# Altium schematic sheet 2_ZynTra-Zynq-Power.SchDoc
size 457 x 279 mm; DocumentNumber: 3; SheetNumber: 2; SheetTotal: 10
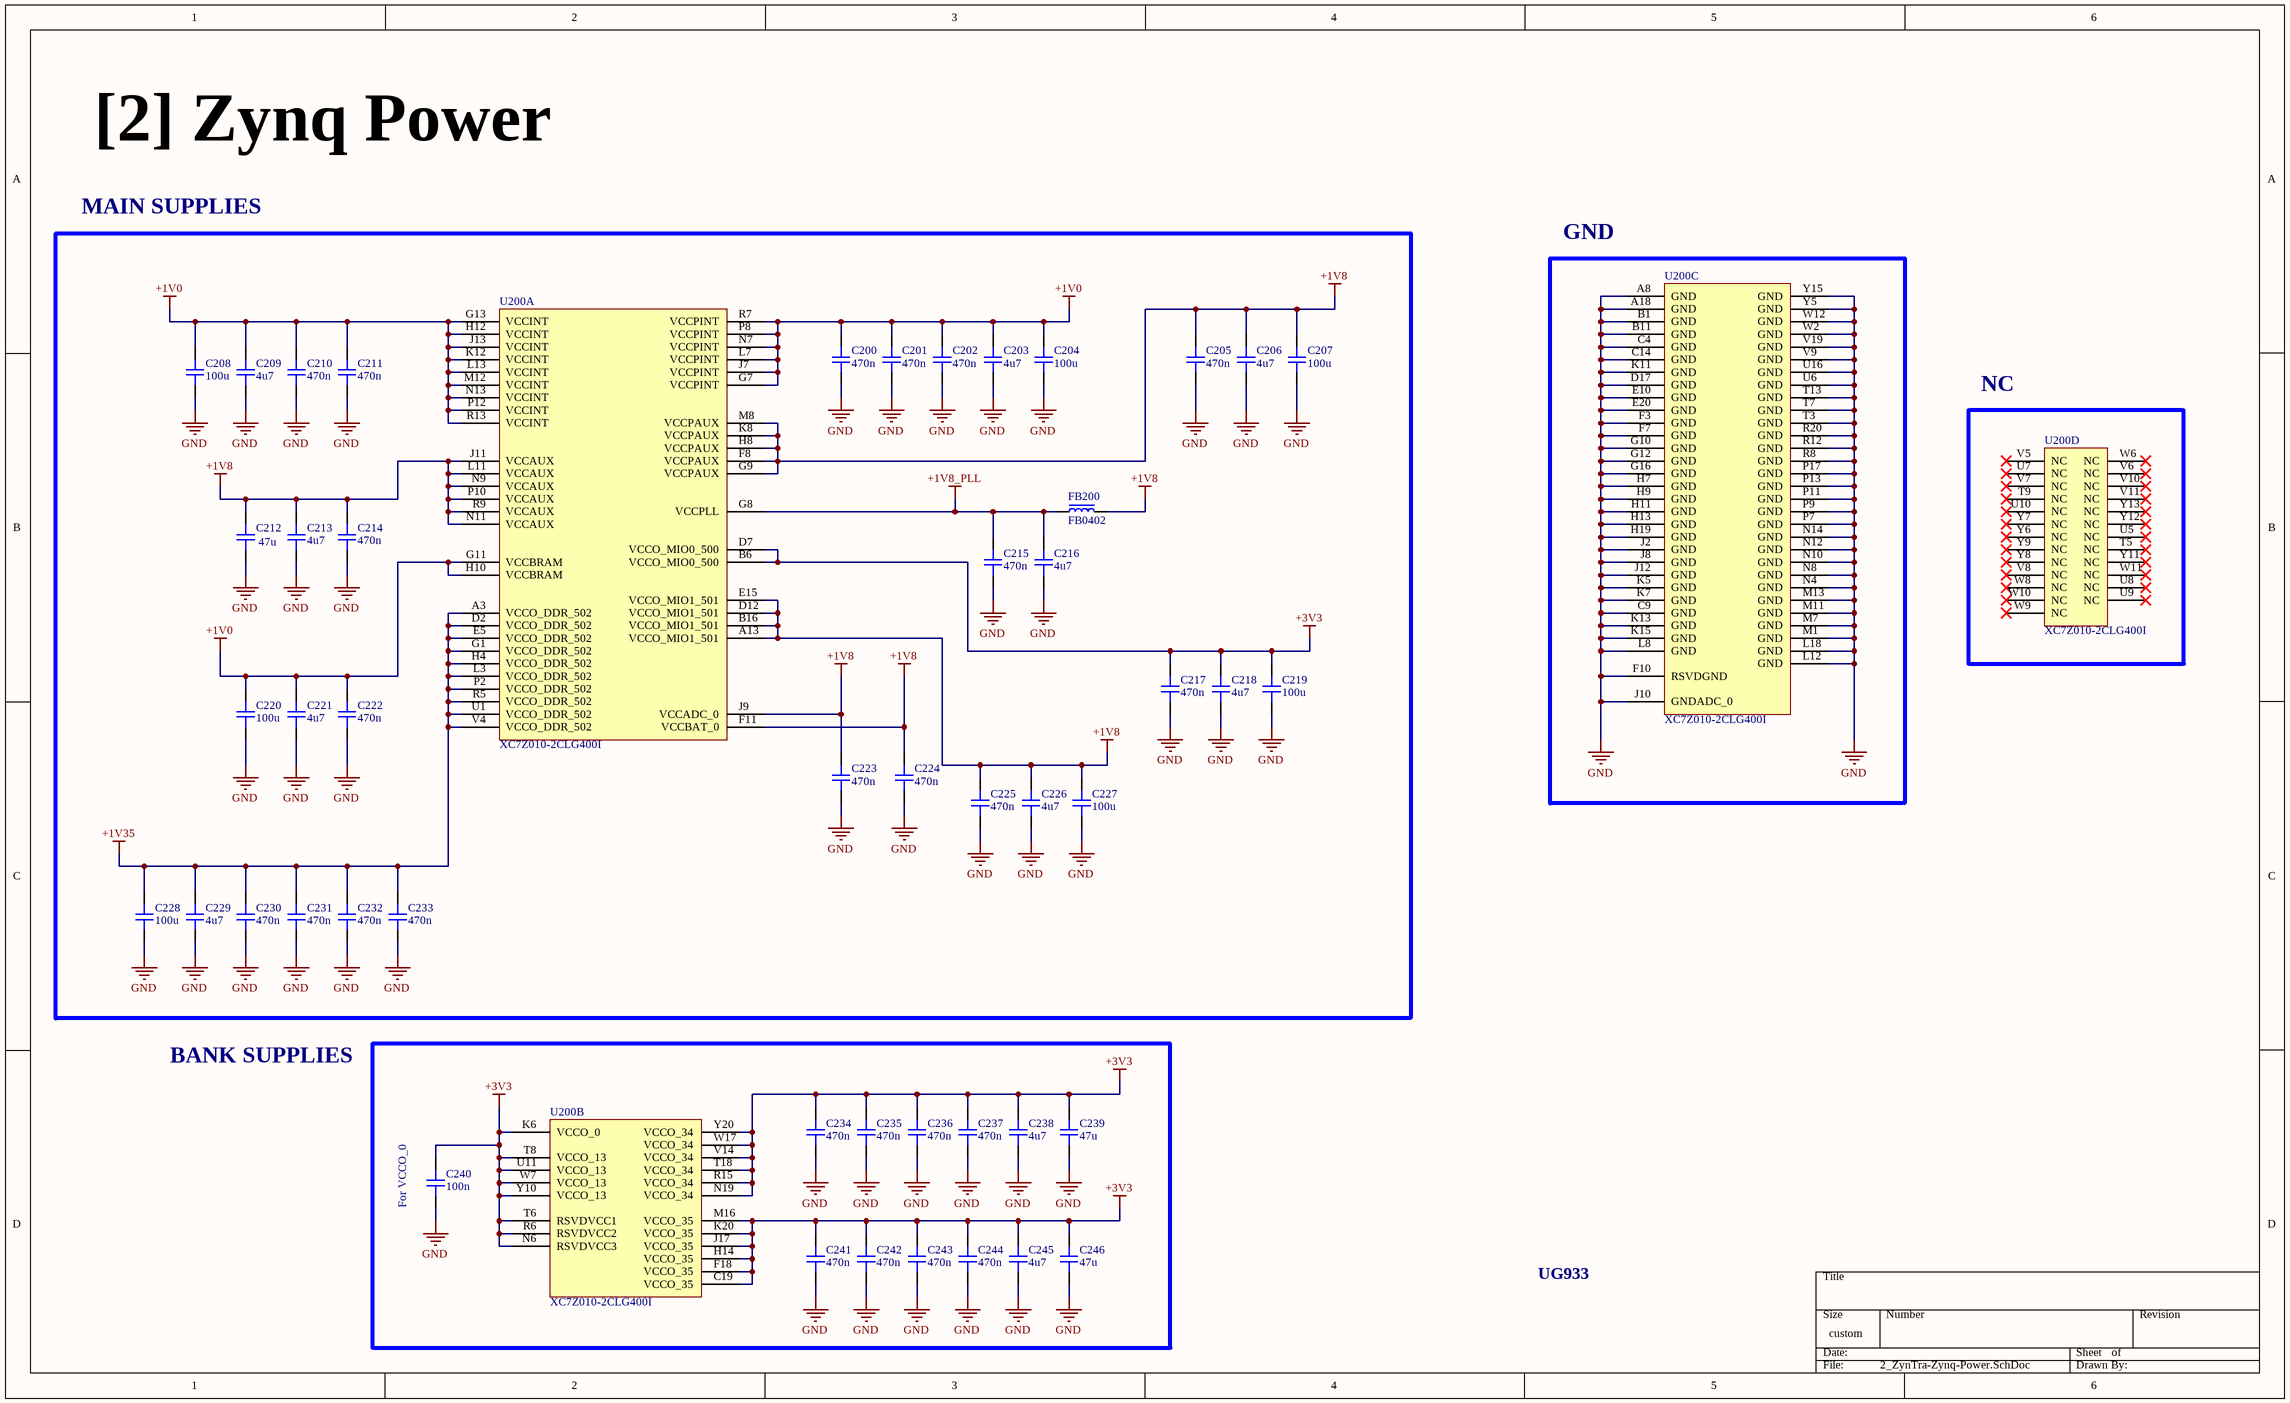
[diagram p0: 2_ZynTra-Zynq-Power.SchDoc]

## Parts
C200  470n  [CAP_0201]
C201  470n  [CAP_0201]
C202  470n  [CAP_0201]
C203  4u7  [CAP_0402]
C204  100u  [CAP_1206]
C205  470n  [CAP_0201]
C206  4u7  [CAP_0402]
C207  100u  [CAP_1206]
C208  100u  [CAP_1206]
C209  4u7  [CAP_0402]
C210  470n  [CAP_0201]
C211  470n  [CAP_0201]
C212  47u  [CAP_1206]
C213  4u7  [CAP_0402]
C214  470n  [CAP_0201]
C215  470n  [CAP_0201]
C216  4u7  [CAP_0402]
C217  470n  [CAP_0201]
C218  4u7  [CAP_0402]
C219  100u  [CAP_1206]
C220  100u  [CAP_1206]
C221  4u7  [CAP_0402]
C222  470n  [CAP_0201]
C223  470n  [CAP_0201]
C224  470n  [CAP_0201]
C225  470n  [CAP_0201]
C226  4u7  [CAP_0402]
C227  100u  [CAP_1206]
C228  100u  [CAP_1206]
C229  4u7  [CAP_0402]
C230  470n  [CAP_0201]
C231  470n  [CAP_0201]
C232  470n  [CAP_0201]
C233  470n  [CAP_0201]
C234  470n  [CAP_0201]
C235  470n  [CAP_0201]
C236  470n  [CAP_0201]
C237  470n  [CAP_0201]
C238  4u7  [CAP_0402]
C239  47u  [CAP_1206]
C240  100n  [CAP_0201]
C241  470n  [CAP_0201]
C242  470n  [CAP_0201]
C243  470n  [CAP_0201]
C244  470n  [CAP_0201]
C245  4u7  [CAP_0402]
C246  47u  [CAP_1206]
FB200  FB0402  [FB_0402]
U200  XC7Z010-2CLG400I  [CLG400, 0.8mm, 17x17]  (parts A,B,C,D of 9)

## Blocks framed on the sheet
MAIN SUPPLIES: C200-C233 FB200 U200
GND: U200
NC: U200
For VCCO_0: C234-C246 U200

## Nets
+1V0: C200.2 C201.2 C202.2 C203.2 C204.2 C208.2 C209.2 C210.2 C211.2 C220.2 C221.2 C222.2 U200.G7(VCCPINT) U200.G11(VCCBRAM) U200.G13(VCCINT) U200.H10(VCCBRAM) U200.H12(VCCINT) U200.J7(VCCPINT) U200.J13(VCCINT) U200.K12(VCCINT) U200.L7(VCCPINT) U200.L13(VCCINT) U200.M12(VCCINT) U200.N7(VCCPINT) U200.N13(VCCINT) U200.P8(VCCPINT) U200.P12(VCCINT) U200.R7(VCCPINT) U200.R13(VCCINT)
+1V8: C205.2 C206.2 C207.2 C212.2 C213.2 C214.2 C223.2 C224.2 C225.2 C226.2 C227.2 FB200.2 U200.A13(VCCO_MIO1_501) U200.B16(VCCO_MIO1_501) U200.D12(VCCO_MIO1_501) U200.E15(VCCO_MIO1_501) U200.F8(VCCPAUX) U200.F11(VCCBAT_0) U200.G9(VCCPAUX) U200.H8(VCCPAUX) U200.J9(VCCADC_0) U200.J11(VCCAUX) U200.K8(VCCPAUX) U200.L11(VCCAUX) U200.M8(VCCPAUX) U200.N9(VCCAUX) U200.N11(VCCAUX) U200.P10(VCCAUX) U200.R9(VCCAUX)
+1V8_PLL: C215.2 C216.2 FB200.1 U200.G8(VCCPLL)
+1V35: C228.2 C229.2 C230.2 C231.2 C232.2 C233.2 U200.A3(VCCO_DDR_502) U200.D2(VCCO_DDR_502) U200.E5(VCCO_DDR_502) U200.G1(VCCO_DDR_502) U200.H4(VCCO_DDR_502) U200.L3(VCCO_DDR_502) U200.P2(VCCO_DDR_502) U200.R5(VCCO_DDR_502) U200.U1(VCCO_DDR_502) U200.V4(VCCO_DDR_502)
+3V3: C217.2 C218.2 C219.2 C234.2 C235.2 C236.2 C237.2 C238.2 C239.2 C240.2 C241.2 C242.2 C243.2 C244.2 C245.2 C246.2 U200.B6(VCCO_MIO0_500) U200.C19(VCCO_35) U200.D7(VCCO_MIO0_500) U200.F18(VCCO_35) U200.H14(VCCO_35) U200.J17(VCCO_35) U200.K6(VCCO_0) U200.K20(VCCO_35) U200.M16(VCCO_35) U200.N6(RSVDVCC3) U200.N19(VCCO_34) U200.R6(RSVDVCC2) U200.R15(VCCO_34) U200.T6(RSVDVCC1) U200.T8(VCCO_13) U200.T18(VCCO_34) U200.U11(VCCO_13) U200.V14(VCCO_34) U200.W7(VCCO_13) U200.W17(VCCO_34) U200.Y10(VCCO_13) U200.Y20(VCCO_34)
GND: C200.1 C201.1 C202.1 C203.1 C204.1 C205.1 C206.1 C207.1 C208.1 C209.1 C210.1 C211.1 C212.1 C213.1 C214.1 C215.1 C216.1 C217.1 C218.1 C219.1 C220.1 C221.1 C222.1 C223.1 C224.1 C225.1 C226.1 C227.1 C228.1 C229.1 C230.1 C231.1 C232.1 C233.1 C234.1 C235.1 C236.1 C237.1 C238.1 C239.1 C240.1 C241.1 C242.1 C243.1 C244.1 C245.1 C246.1 U200.A8(GND) U200.A18(GND) U200.B1(GND) U200.B11(GND) U200.C4(GND) U200.C9(GND) U200.C14(GND) U200.D17(GND) U200.E10(GND) U200.E20(GND) U200.F3(GND) U200.F7(GND) U200.F10(RSVDGND) U200.G10(GND) U200.G12(GND) U200.G16(GND) U200.H7(GND) U200.H9(GND) U200.H11(GND) U200.H13(GND) U200.H19(GND) U200.J2(GND) U200.J8(GND) U200.J10(GNDADC_0) U200.J12(GND) U200.K5(GND) U200.K7(GND) U200.K11(GND) U200.K13(GND) U200.K15(GND) U200.L8(GND) U200.L12(GND) U200.L18(GND) U200.M1(GND) U200.M7(GND) U200.M11(GND) U200.M13(GND) U200.N4(GND) U200.N8(GND) U200.N10(GND) U200.N12(GND) U200.N14(GND) U200.P7(GND) U200.P9(GND) U200.P11(GND) U200.P13(GND) U200.P17(GND) U200.R8(GND) U200.R12(GND) U200.R20(GND) U200.T3(GND) U200.T7(GND) U200.T13(GND) U200.U6(GND) U200.U16(GND) U200.V9(GND) U200.V19(GND) U200.W2(GND) U200.W12(GND) U200.Y5(GND) U200.Y15(GND)

Not connected (* = marked no-connect by the designer): U200 T5(NC)* T9(NC)* U5(NC)* U7(NC)* U8(NC)* U9(NC)* U10(NC)* V5(NC)* V6(NC)* V7(NC)* V8(NC)* V10(NC)* V11(NC)* W6(NC)* W8(NC)* W9(NC)* W10(NC)* W11(NC)* Y6(NC)* Y7(NC)* Y8(NC)* Y9(NC)* Y11(NC)* Y12(NC)* Y13(NC)*

## Notes on the sheet
- [2] Zynq Power
- BANK SUPPLIES
- UG933

## Library data of the parts
C200-C202 C205 C210 C211 C214 C215 C217 C222-C225 C230-C237 C240-C244 = CAP_0201: Capacitor SMD 0201; Manufacturer: *; Manufacturer Part Number: *; Distributor Link: *; LCSC: *; Rating: *; Dielectric: *
C203 C206 C209 C213 C216 C218 C221 C226 C229 C238 C245 = CAP_0402: Capacitor SMD 0402; Manufacturer: *; Manufacturer Part Number: *; Distributor Link: *; LCSC: *; Rating: *; Dielectric: *
C204 C207 C208 C212 C219 C220 C227 C228 C239 C246 = CAP_1206: Capacitor SMD 1206; Manufacturer: *; Manufacturer Part Number: *; Distributor Link: *; LCSC: *; Rating: *; Dielectric: *
FB200 = FB_0402: Ferrite Bead SMD 0402; Manufacturer: *; Manufacturer Part Number: *; Distributor Link: *; LCSC: *
U200 = XC7Z010-2CLG400I: Zynq 7000S SoC devices feature a single-core Arm® Cortex®-A9 processor mated with 28 nm AMD Artix™ 7 based programmable logic, representing a low cost entry point to the scalable Zynq 7000 platform. Available with 6.25 Gb/s transceivers and outfitted with commonly used hardened peripherals, the Zynq 7000S delivers cost-optimized system integration ideal for industrial IoT applications such as motor control and embedded vision.; Manufacturer: AMD / Xilinx; Manufacturer Part Number: XC7Z010-2CLG400I; Supplier Link: https://www.mouser.com.tr/ProductDetail/AMD-Xilinx/XC7Z010-2CLG400I?qs=rrS6PyfT74cETvLeyRFHTA%3D%3D